# EAGLE design pcb (EAGLE 6.5.0)
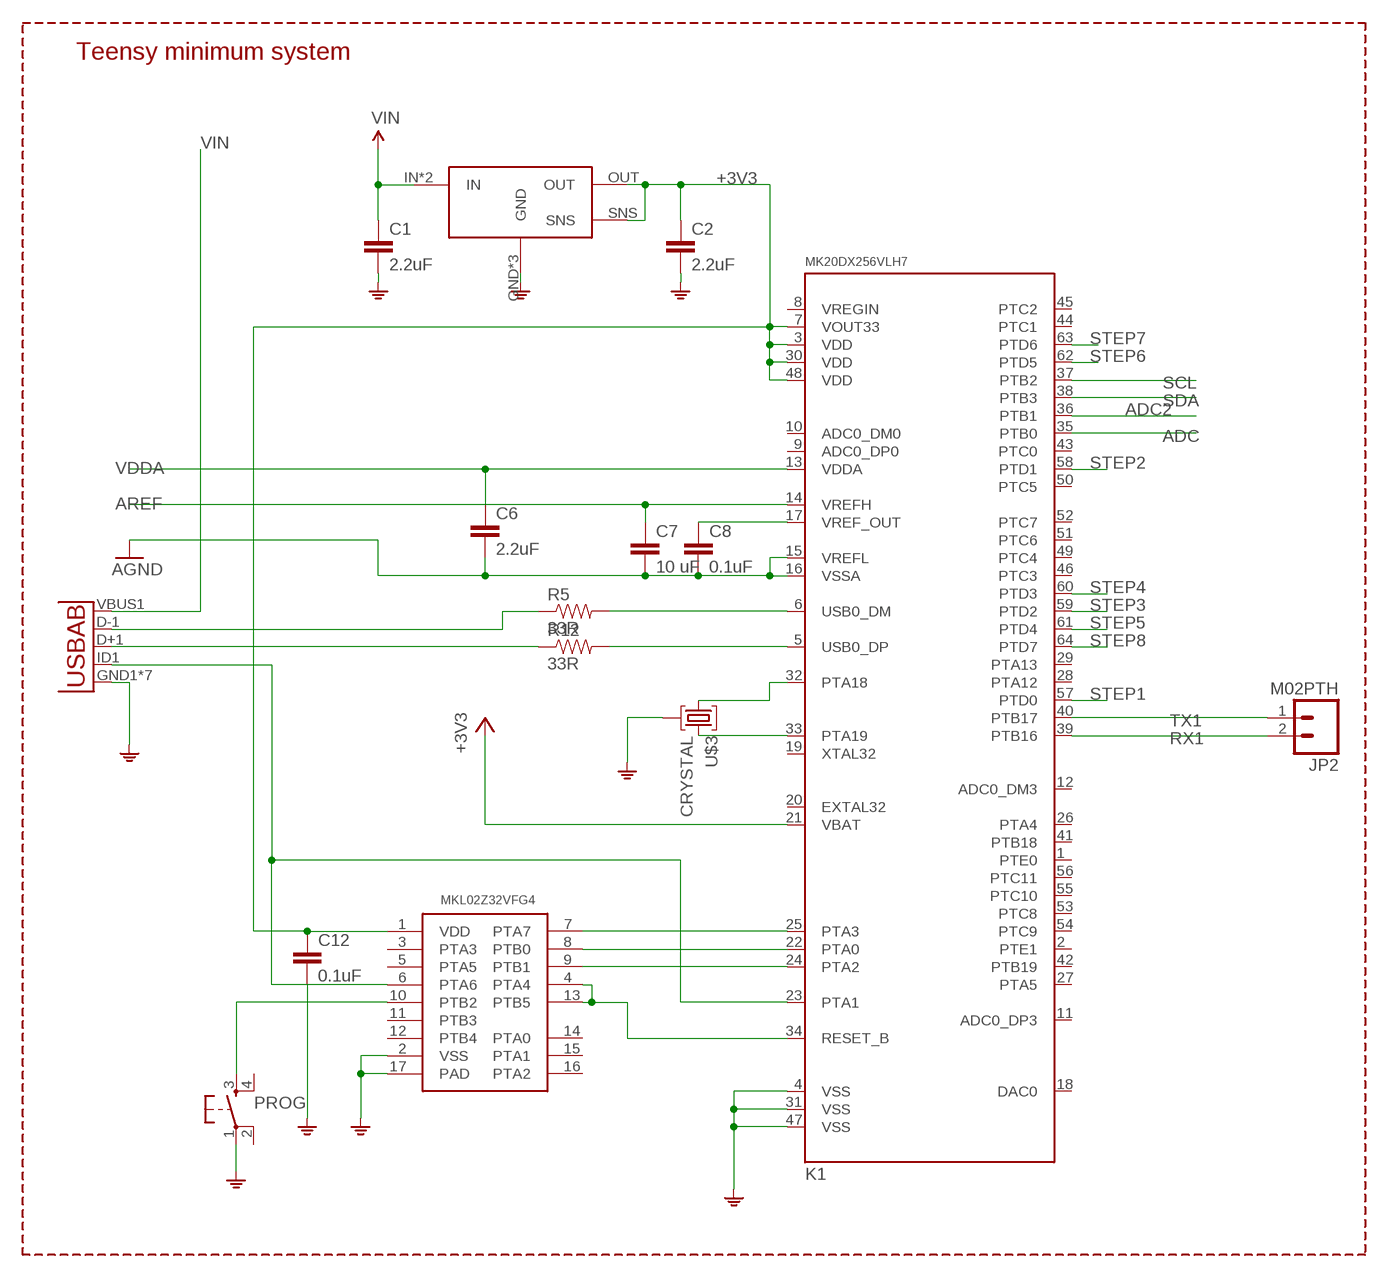
[diagram p0: schematic, sheet 1, part 1 of 2]
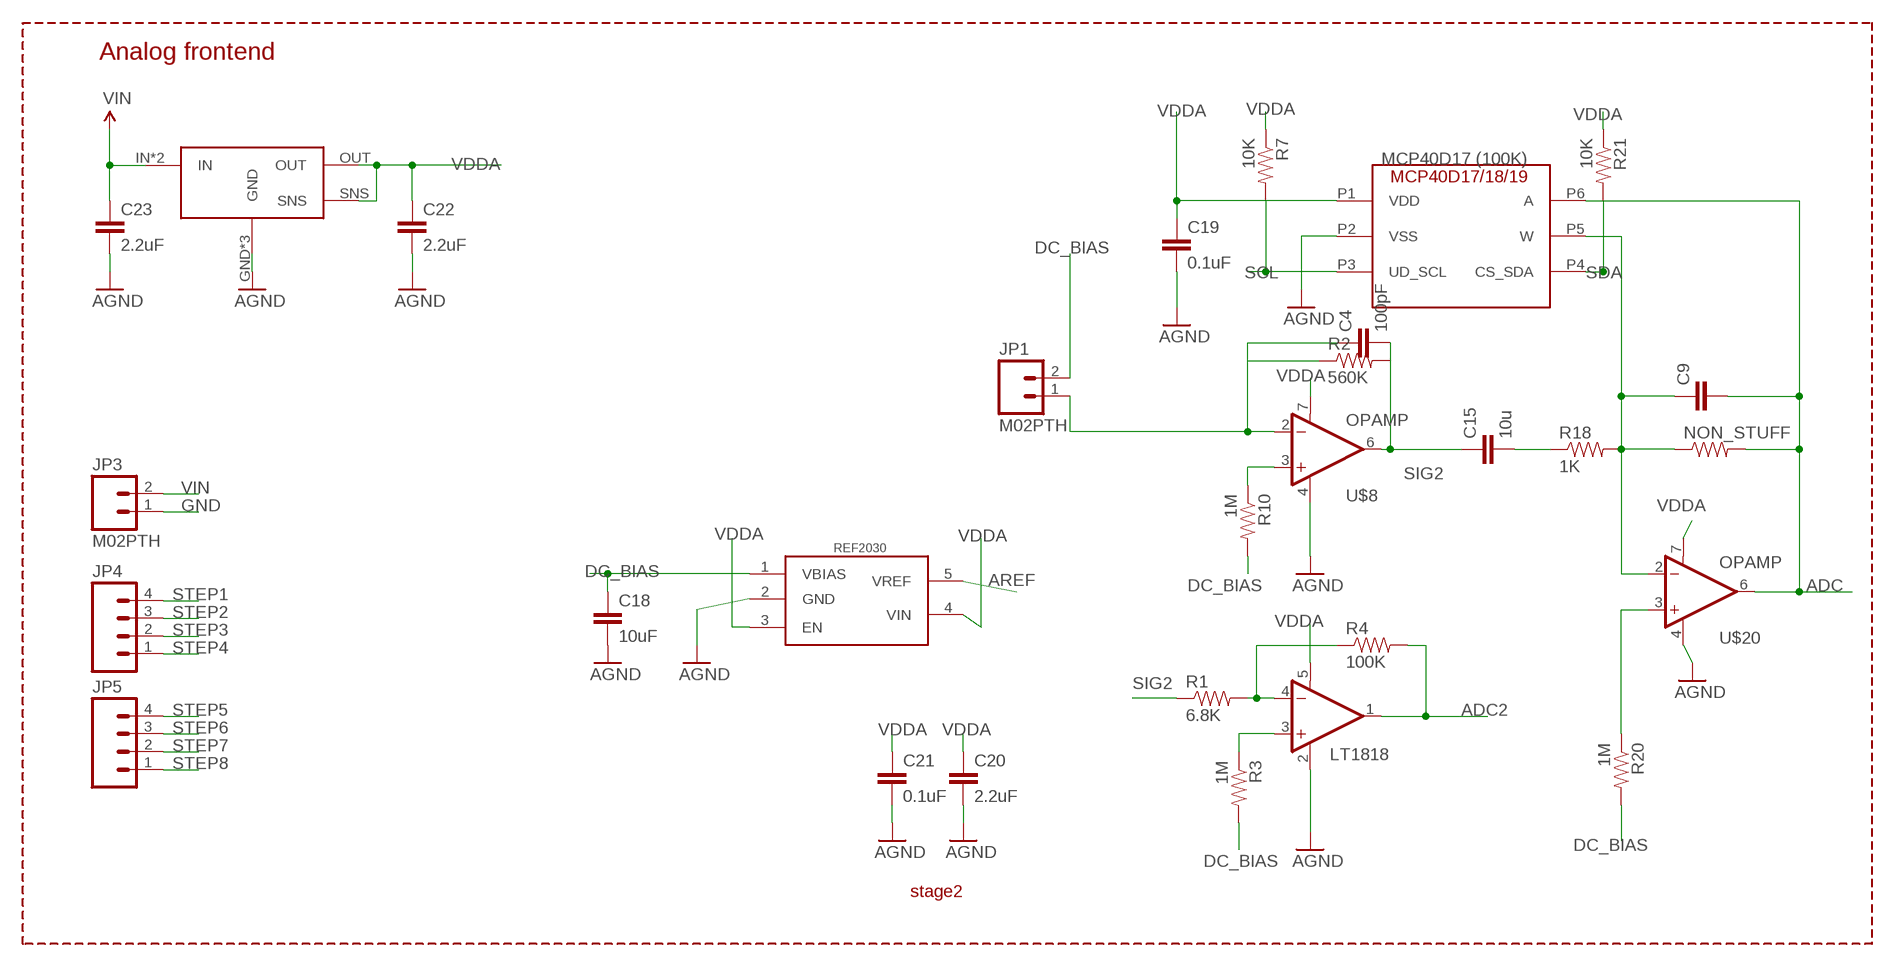
[diagram p1: schematic, sheet 1, part 2 of 2]

## Parts
C1  2.2uF  0.1UF-16V(+-10%)(0402)  [0402-CAP]
C2  2.2uF  0.1UF-16V(+-10%)(0402)  [0402-CAP]
C4  100pF  0.1UF-16V(+-10%)(0402)  [0402-CAP]
C6  2.2uF  0.1UF-16V(+-10%)(0402)  [0402-CAP]
C7  10 uF  0.1UF-16V(+-10%)(0402)  [0402-CAP]
C8  0.1uF  0.1UF-16V(+-10%)(0402)  [0402-CAP]
C9  C-EUC0402  [C0402]
C12  0.1uF  0.1UF-16V(+-10%)(0402)  [0402-CAP]
C15  10u  C-EUC0402  [C0402]
C18  10uF  0.1UF-16V(+-10%)(0402)  [0402-CAP]
C19  0.1uF  0.1UF-16V(+-10%)(0402)  [0402-CAP]
C20  2.2uF  0.1UF-25V(+80/-20%)(0603)  [0603-CAP]
C21  0.1uF  0.1UF-16V(+-10%)(0402)  [0402-CAP]
C22  2.2uF  0.1UF-16V(+-10%)(0402)  [0402-CAP]
C23  2.2uF  0.1UF-16V(+-10%)(0402)  [0402-CAP]
JP1  M02PTH  [1X02]
JP2  M02PTH  [1X02]
JP3  M02PTH  [1X02]
JP4  M04PTH  [1X04]
JP5  M04PTH  [1X04]
K1  MK20DX256VLH7  [LQFP64-05]
LP1  LP38691SD  [WSON_6]
LP38691  LP38691SD  [WSON_6]
NON_STUFF  RESISTOR0402  [0402-RES]
PROG  KMR211GLFS  TAC_SWITCHSMD  [TACTILE_SWITCH_SMD]
R1  6.8K  RESISTOR0402  [0402-RES]
R2  560K  RESISTOR0402  [0402-RES]
R3  1M  RESISTOR0402  [0402-RES]
R4  100K  RESISTOR0402  [0402-RES]
R5  33R  22OHM1/10W1%(0402)  [0402-RES]
R7  10K  RESISTOR0402  [0402-RES]
R10  1M  RESISTOR0402  [0402-RES]
R12  33R  22OHM1/10W1%(0402)  [0402-RES]
R18  1K  RESISTOR0402  [0402-RES]
R20  1M  RESISTOR0402  [0402-RES]
R21  10K  RESISTOR0402  [0402-RES]
REF2030  REF2033  [SOT23]
U5  USB""  [USB-MICRO-SMD]
U14  LT1818  OPA344  [SOT23-5]
U$3  CRYSTAL  [CRYSTAL]
U$6  MCP40D17/18/19  [SC70-6]
U$8  OPAMP  [8-SOIC]
U$14  MKL02Z32VFG4_  [QFN16_3X3]
U$20  OPAMP  [8-SOIC]

## Nets
+3V3: C2.1 C12.1 K1.3(VDD) K1.7(VOUT33) K1.21(VBAT) K1.30(VDD) K1.48(VDD) LP38691.OUT LP38691.SNS U$14.1(VDD)
ADC: C9.2 K1.35(PTB0) NON_STUFF.2 U$6.P6(A) U$20.6(OUT)
ADC2: K1.36(PTB1) R4.2 U14.1(OUT)
AGND: C6.2 C7.2 C8.2 C18.2 C19.2 C20.2 C21.2 C22.2 C23.2 K1.15(VREFL) K1.16(VSSA) LP1.GND LP1.N/C(GND) LP1.THERMAL(GND) REF2030.2(GND) U14.2(V-) U$6.P2(VSS) U$8.4(V-) U$20.4(V-)
AREF: C7.1 K1.14(VREFH) REF2030.5(VREF)
DC_BIAS: C18.1 JP1.2 R3.2 R10.2 R20.2 REF2030.1(VBIAS)
GND: C1.2 C2.2 C12.2 JP3.1 K1.4(VSS) K1.31(VSS) K1.47(VSS) LP38691.GND LP38691.N/C(GND) LP38691.THERMAL(GND) PROG.1 U5.GND1(GND) U5.P$1(GND) U5.P$2(GND) U5.P$3(GND) U5.P$4(GND) U5.P$5(GND) U5.P$6(GND) U$3.GND1 U$3.GND2 U$14.2(VSS) U$14.17(PAD)
N$1: C4.1 JP1.1 R2.1 U$8.2(-IN)
N$2: R1.2 R4.1 U14.4(-IN)
N$3: C9.1 NON_STUFF.1 R18.2 U$6.P5(W) U$20.2(-IN)
N$4: K1.32(PTA18) U$3.SIG1
N$5: K1.33(PTA19) U$3.SIG2
N$8: K1.24(PTA2) U$14.9(PTB1)
N$10: R10.1 U$8.3(+IN)
N$11: K1.22(PTA0) U$14.8(PTB0)
N$12: R3.1 U14.3(+IN)
N$14: C8.1 K1.17(VREF_OUT)
N$15: C15.2 R18.1
N$16: K1.5(USB0_DP) R12.2
N$17: K1.6(USB0_DM) R5.2
N$19: R12.1 U5.D+1(D+)
N$20: R5.1 U5.D-1(D-)
N$22: K1.23(PTA1) U5.ID1(USBID) U$14.6(PTA6)
N$23: R20.1 U$20.3(+IN)
N$66: PROG.3 U$14.10(PTB2)
N$72: K1.25(PTA3) U$14.7(PTA7)
RST: K1.34(RESET_B) U$14.4(PTA4) U$14.13(PTB5)
RX1: JP2.2 K1.39(PTB16)
SCL: K1.37(PTB2) R7.2 U$6.P3(UD_SCL)
SDA: K1.38(PTB3) R21.2 U$6.P4(CS_SDA)
SIG2: C4.2 C15.1 R1.1 R2.2 U$8.6(OUT)
STEP1: JP4.4 K1.57(PTD0)
STEP2: JP4.3 K1.58(PTD1)
STEP3: JP4.2 K1.59(PTD2)
STEP4: JP4.1 K1.60(PTD3)
STEP5: JP5.4 K1.61(PTD4)
STEP6: JP5.3 K1.62(PTD5)
STEP7: JP5.2 K1.63(PTD6)
STEP8: JP5.1 K1.64(PTD7)
TX1: JP2.1 K1.40(PTB17)
VDDA: C6.1 C19.1 C20.1 C21.1 C22.1 K1.13(VDDA) LP1.OUT LP1.SNS R7.1 R21.1 REF2030.3(EN) REF2030.4(VIN) U14.5(V+) U$6.P1(VDD) U$8.7(V+) U$20.7(V+)
VIN: C1.1 C23.1 JP3.2 LP1.IN LP1.IN2(IN) LP38691.IN LP38691.IN2(IN) U5.VBUS1(VBUS)
Unconnected: K1.1(PTE0) K1.2(PTE1) K1.8(VREGIN) K1.9(ADC0_DP0) K1.10(ADC0_DM0) K1.11(ADC0_DP3) K1.12(ADC0_DM3) K1.18(DAC0) K1.19(XTAL32) K1.20(EXTAL32) K1.26(PTA4) K1.27(PTA5) K1.28(PTA12) K1.29(PTA13) K1.41(PTB18) K1.42(PTB19) K1.43(PTC0) K1.44(PTC1) K1.45(PTC2) K1.46(PTC3) K1.49(PTC4) K1.50(PTC5) K1.51(PTC6) K1.52(PTC7) K1.53(PTC8) K1.54(PTC9) K1.55(PTC10) K1.56(PTC11) PROG.2 PROG.4 U$14.3(PTA3) U$14.5(PTA5) U$14.11(PTB3) U$14.12(PTB4) U$14.14(PTA0) U$14.15(PTA1) U$14.16(PTA2)

## Notes on the sheet
- Teensy minimum system
- Analog frontend
- MCP40D17 (100K)
- stage2

## Library data of the parts
C1 C2 C4 C6 C7 C18 C22 C23 = SparkFun-Capacitors:0.1UF-16V(+-10%)(0402); PROD_ID: CAP-12416; VALUE: 0.1uF
C8 C12 C19 C21 = SparkFun-Capacitors:0.1UF-16V(+-10%)(0402); PROD_ID: CAP-12416
C9 C15 = resistor:C-EU: CAPACITOR, European symbol
C20 = SparkFun-Capacitors:0.1UF-25V(+80/-20%)(0603): CAP-00810 Ceramic Standard decoupling cap; PROD_ID: CAP-00810; VALUE: 0.1uF
JP1-JP3 = SparkFun-Connectors:M02: Standard 2-pin 0.1" header. Use with - straight break away headers ( PRT-00116) - right angle break away headers (PRT-00553) - swiss pins (PRT-00743) - machine pins (PRT-00117) - female headers (PRT-00115) Molex polarized connector foot print use with: PRT-08233 with associated crimp pins and housings. 2.54_SCREWTERM for use with PRT-10571. 3.5mm Screw Terminal footprints for PRT-08084 5mm Screw Terminal footprints for use with PRT-08432
JP4 JP5 = SparkFun-Connectors:M04: Header 4 Standard 4-pin 0.1" header. Use with straight break away headers (SKU : PRT-00116), right angle break away headers (PRT-00553), swiss pins (PRT-00743), machine pins (PRT-00117), and female headers (PRT-00115). Molex polarized connector foot print use with SKU : PRT-08231 with associated crimp pins and housings. 1MM SMD Version SKU: PRT-10208
K1 = t32_ref:MK20DX256VLH7; DESC: MK20DX256VLH7; MF: NXP; MPN: MK20DX256VLH7; OC_MOUSER: 841-MK20DX256VLH7; PACKAGE: LQFP-64; TYPE: Microcontroller
LP1 LP38691 = Teensy_3_and_LC_Series_Boards_v1.1:LP38691SD
NON_STUFF R1-R4 R7 R10 R18 R20 R21 = SparkFun-Resistors:RESISTOR: Resistor Basic schematic elements and footprints for 0603, 1206, and PTH resistors.
PROG = Spark:TAC_SWITCH: SMD Tactiile Switch
R5 R12 = SparkFun-Resistors:22OHM1/10W1%(0402); PROD_ID: RES-12427; VALUE: 22
REF2030 = Teensy_3_and_LC_Series_Boards_v1.1:REF2033
U5 = MicroUSB:USB: This is a USB AB connector that is compatible with USB OTG. i.e. this connector can serve as a host or device
U14 = SparkFun:OPA344
U$3 = Teensy_3_and_LC_Series_Boards_v1.1:CRYSTAL
U$6 = ff3:MCP40D17/18/19
U$8 U$20 = Teensy_3_and_LC_Series_Boards_v1.1:OPAMP
U$14 = Teensy_3_and_LC_Series_Boards_v1.1:MKL02Z32VFG4_

## Board
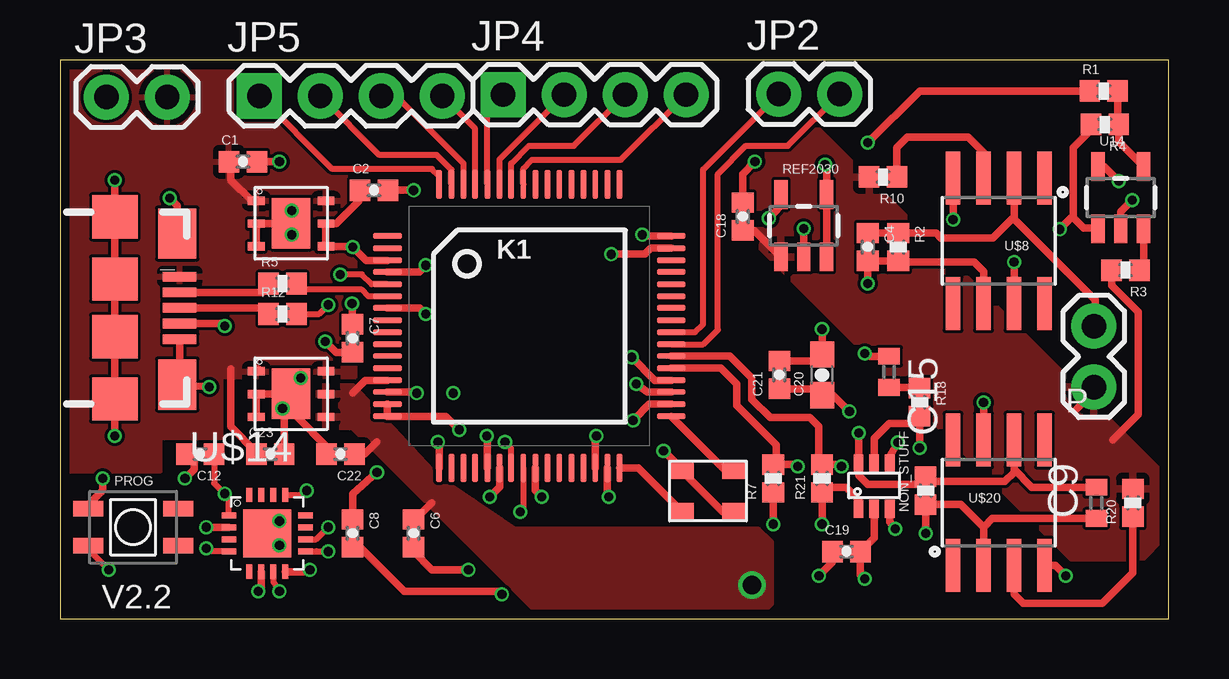
[diagram p2: board, top side]
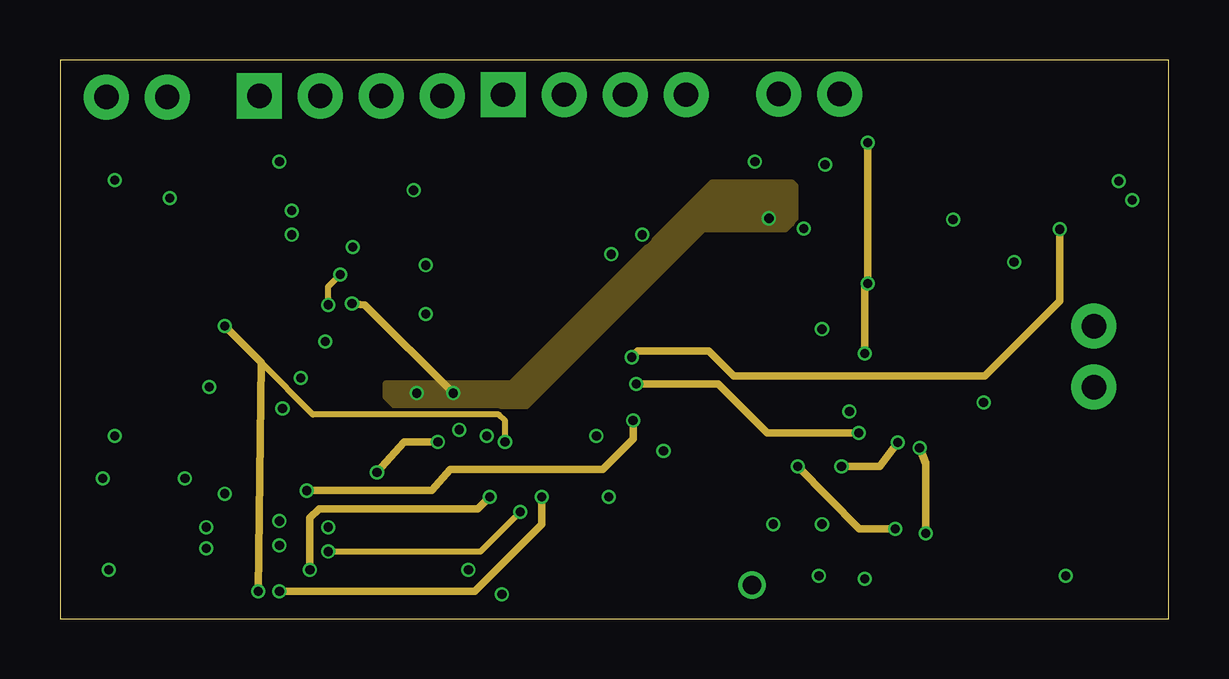
[diagram p3: board, inner layer Route2]
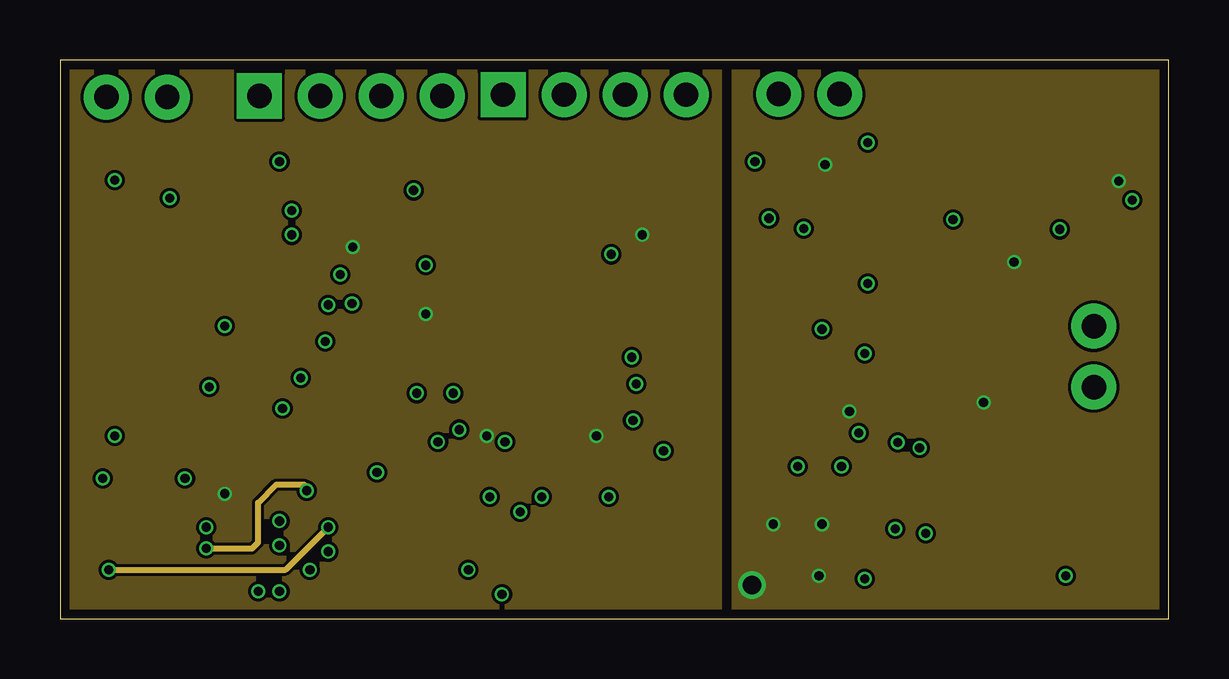
[diagram p4: board, inner layer Route15]
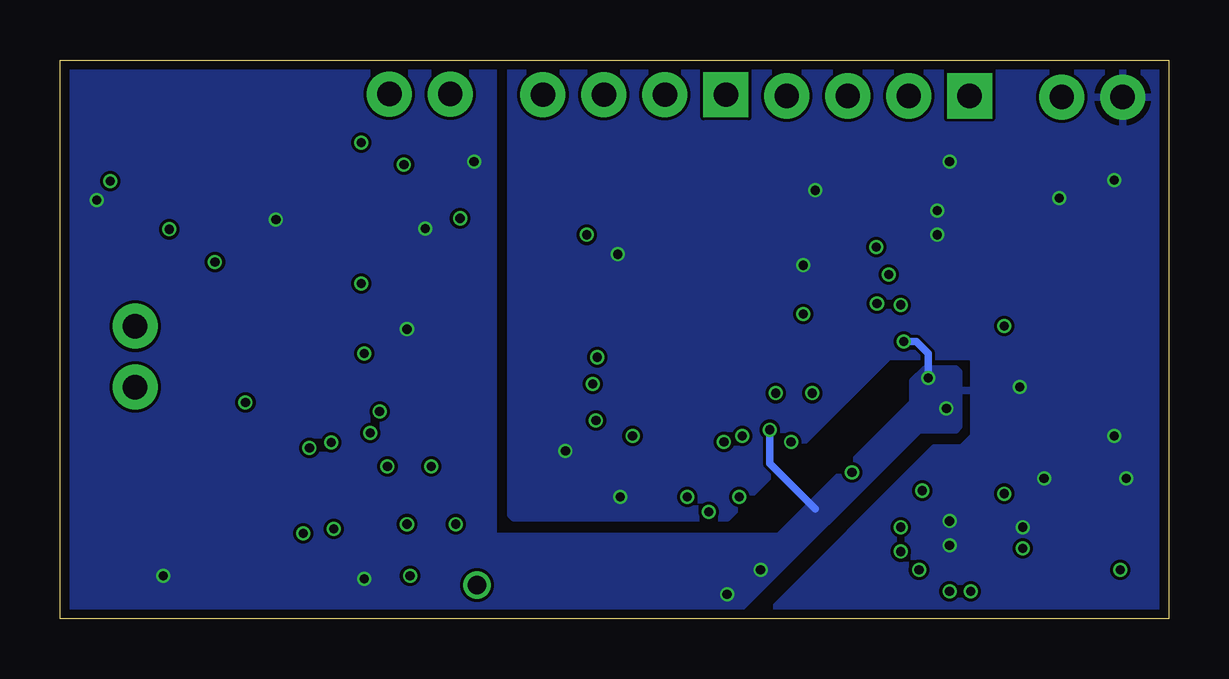
[diagram p5: board, bottom side, seen from below]

Size 46.21 x 23.29 mm. Coordinates in mm from the lower left corner, seen from the top.
Outline: 0,0 46.21,0 46.21,23.29 0,23.29 0,0
Copper layers (1*2*15*16): Top 0.035559375mm / dielectric 0.17018125mm / Route2 0.01778125mm / dielectric 47mil / Route15 0.01778125mm / dielectric 0.17018125mm / Bottom 0.035559375mm
Design rules "OSHPark-4layer": minimum track width 5mil, minimum drill 10mil, track to track 5mil, track to pad 5mil, pad to pad 5mil, via to via 5mil, smd to smd 5mil, copper to edge 15mil, drill to drill 6mil, minimum pad ring 4mil, minimum via ring 4mil, stop-mask expansion 2.5mil, vias tented up to drill 0mil, thermal gap 10mil

### Footprints (pad centres in the part's own frame; a part is rotated, then mirrored left to right if it is on the bottom)
0402-CAP = smd 0.85 x 0.9: 1 -0.58,0; 2 0.58,0
C0402 = smd 0.7 x 0.9: 1 -0.65,0; 2 0.65,0
0603-CAP = smd 1.1 x 1: 1 -0.85,0; 2 0.85,0
1X02 = drill 1.016 pad 1.88: 1 0,0; 2 2.54,0
1X04 = drill 1.016 pad 1.88 square: 1 0,0 | drill 1.016 pad 1.88: 2 2.54,0; 3 5.08,0; 4 7.62,0
LQFP64-05 = smd 1.2 x 0.25: 1 -5.915,3.759; 2 -5.915,3.251; 3 -5.915,2.743; 4 -5.915,2.261; 5 -5.915,1.753; 6 -5.915,1.245; 7 -5.915,0.762; 8 -5.915,0.254; 9 -5.915,-0.254; 10 -5.915,-0.762; 11 -5.915,-1.245; 12 -5.915,-1.753; 13 -5.915,-2.261; 14 -5.915,-2.743; 15 -5.915,-3.251; 16 -5.915,-3.759; 33 5.915,-3.759; 34 5.915,-3.251; 35 5.915,-2.743; 36 5.915,-2.261; 37 5.915,-1.753; 38 5.915,-1.245; 39 5.915,-0.762; 40 5.915,-0.254; 41 5.915,0.254; 42 5.915,0.762; 43 5.915,1.245; 44 5.915,1.753; 45 5.915,2.261; 46 5.915,2.743; 47 5.915,3.251; 48 5.915,3.759 | smd 0.25 x 1.2: 17 -3.759,-5.915; 18 -3.251,-5.915; 19 -2.743,-5.915; 20 -2.261,-5.915; 21 -1.753,-5.915; 22 -1.245,-5.915; 23 -0.762,-5.915; 24 -0.254,-5.915; 25 0.254,-5.915; 26 0.762,-5.915; 27 1.245,-5.915; 28 1.753,-5.915; 29 2.261,-5.915; 30 2.743,-5.915; 31 3.251,-5.915; 32 3.759,-5.915; 49 3.759,5.915; 50 3.251,5.915; 51 2.743,5.915; 52 2.261,5.915; 53 1.753,5.915; 54 1.245,5.915; 55 0.762,5.915; 56 0.254,5.915; 57 -0.254,5.915; 58 -0.762,5.915; 59 -1.245,5.915; 60 -1.753,5.915; 61 -2.261,5.915; 62 -2.743,5.915; 63 -3.251,5.915; 64 -3.759,5.915
WSON_6 = smd 0.7 x 0.35: GND -1.472,-0.042; IN -1.472,0.908; IN2 1.428,0.908; N/C -1.472,-0.992; OUT 1.428,-0.992; SNS 1.428,-0.042 | smd 1.6 x 2.1: THERMAL -0.024,-0.024
0402-RES = smd 0.85 x 0.9: 1 -0.58,0; 2 0.58,0
TACTILE_SWITCH_SMD = smd 1.25 x 0.65: 1 -1.875,0.775; 2 1.875,0.775; 3 -1.875,-0.775; 4 1.875,-0.775
SOT23 = smd 0.55 x 1.2: 1 -0.95,-1.3; 2 0,-1.3; 3 0.95,-1.3; 4 0.95,1.3; 5 -0.95,1.3
USB-MICRO-SMD = smd 1.4 x 0.4: D+1 2.7,0; D-1 2.7,0.65; GND1 2.7,-1.3; ID1 2.7,-0.65; VBUS1 2.7,1.3 | smd 1.6 x 2.1: P$1 2.6,3.1; P$2 2.6,-3.2 | smd 1.9 x 1.8: P$3 0,-3.8; P$4 0,3.8; P$5 0,1.2; P$6 0,-1.2
SOT23-5 = smd 0.55 x 1.2: 1 -0.95,-1.3; 2 0,-1.3; 3 0.95,-1.3; 4 0.95,1.3; 5 -0.95,1.3
CRYSTAL = smd 1 x 0.7: GND1 0.5,2.1; GND2 2.7,0.4; SIG1 0.5,0.4; SIG2 2.7,2.1
SC70-6 = smd 0.4 x 0.75: P1 -0.762,-1.016; P2 -0.112,-1.016; P3 0.538,-1.016; P4 0.538,0.884; P5 -0.112,0.884; P6 -0.762,0.884
8-SOIC = smd 0.61 x 2.21: 1 -1.905,-2.616; 2 -0.635,-2.616; 3 0.635,-2.616; 4 1.905,-2.616; 5 1.905,2.616; 6 0.635,2.616; 7 -0.635,2.616; 8 -1.905,2.616
QFN16_3X3 = smd 0.6 x 0.25: 1 -1.6,0.75; 2 -1.6,0.25; 3 -1.6,-0.25; 4 -1.6,-0.75; 9 1.6,-0.75; 10 1.6,-0.25; 11 1.6,0.25; 12 1.6,0.75 | smd 0.25 x 0.6: 5 -0.75,-1.6; 6 -0.25,-1.6; 7 0.25,-1.6; 8 0.75,-1.6; 13 0.75,1.6; 14 0.25,1.6; 15 -0.25,1.6; 16 -0.75,1.6 | smd 2 x 2: 17 0,0

### Placement (x,y rotation side)
C1  7.62,19.05 0 top
C2  13.08,17.86 0 top
C4  33.66,15.49 270 top
C6  14.73,3.56 270 top
C7  12.19,11.68 270 top
C8  12.19,3.56 270 top
C9  43.18,4.83 90 top
C12  5.84,6.86 180 top
C15  34.54,10.29 270 top
C18  28.45,16.76 90 top
C19  32.77,2.79 0 top
C20  31.75,10.16 90 top
C21  29.97,10.16 90 top
C22  11.68,6.86 180 top
C23  8.76,6.86 0 top
JP1  43.08,12.19 270 top
JP2  29.95,21.87 0 top
JP3  1.93,21.74 0 top
JP4  18.47,21.84 0 top
JP5  8.31,21.79 0 top
K1  19.56,12.19 0 top
LP1  9.65,9.4 0 top
LP38691  9.65,16.51 0 top
NON_STUFF  36.07,5.33 90 top
PROG  3.05,3.81 0 top
R1  43.48,22 0 top
R2  34.92,15.49 270 top
R3  44.4,14.53 180 top
R4  43.54,20.6 180 top
R5  9.27,13.97 0 top
R7  29.72,5.84 90 top
R10  34.29,18.41 180 top
R12  9.27,12.7 0 top
R18  35.81,9.02 270 top
R20  44.7,4.83 90 top
R21  31.75,5.84 90 top
REF2030  30.99,16.38 0 top
U5  2.29,12.95 0 top
U14  44.2,17.55 0 top
U$3  25.4,4.06 0 top
U$6  34.04,5.59 0 top
U$8  39.12,15.75 180 top
U$14  8.64,3.56 0 top
U$20  39.12,4.83 0 top

### Tracks (layer width: path | path; a pad name or v marks a point on that pad's centre or on a via)
+3V3  (via drill 0.38)
  Top 0.254: U$14.1 7.04,5.03 v6.86,5.21 6.42,5.64 C12.1
  Top 0.305: K1.3 12.75,14.94 v12.19,15.49 12.17,15.52 LP38691.OUT LP38691.SNS 11.52,16.47 12.45,17.4 12.5,17.57 C2.1 | K1.7 14.99,12.95 v15.24,12.7 | K1.21 17.8,7.59 v17.78,7.62 | K1.30 22.3,7.57 v22.35,7.62 | K1.48 24.31,15.95 v24.26,16
  pour Route15: 0,23.62 27.43,23.62 27.43,0 0,0
ADC  (via drill 0.38)
  Top 0.305: C9.2 40.5,5.48 39.75,6.22 | 39.75,6.22 U$20.6 | K1.35 24.46,9.45 v24,9.78 | 39.75,6.22 39.75,6.1 39.37,5.72 36.27,5.72 NON_STUFF.2 35.74,5.59 33.66,5.59 33.27,5.97 U$6.P6 v33.27,7.75
  Route2 0.305: v24,9.78 27.43,9.78 29.46,7.75 v33.27,7.75
ADC2  (via drill 0.38)
  Top 0.305: R4.2 42.96,20.38 42.22,19.63 42.22,16.71 | 42.22,16.71 42.65,16.28 43.22,16.28 U14.1 | K1.36 24.79,9.93 v23.82,10.9 | 42.22,16.71 42.14,16.71 v41.66,16.23
  Route2 0.305: v41.66,16.23 41.66,13.23 38.53,10.11 28.07,10.11 27.03,11.15 24.08,11.15 v23.82,10.9
AGND  (via drill 0.38)
  Top 0.305: U$8.4 v37.21,16.64 | REF2030.2 v30.99,16.26 | C18.2 28.45,18.54 v28.96,19.05 | v31.75,12.07 C20.2 31.48,10.74 C21.2 | v33.53,1.65 33.35,1.83 C19.2 33.92,3.37 U$6.P2 | U$20.4 41.48,2.21 v41.91,1.78 | LP1.THERMAL 9.61,9.36 LP1.GND LP1.N/C | 14.99,2.92 14.93,2.98 C6.2 14.73,2.79 15.49,2.03 v17.02,2.03 | LP1.THERMAL 9.27,9.02 v9.27,8.76 9.34,8.69 C23.2 | v10.03,10.03 10.03,9.78 LP1.THERMAL | C22.2 11.1,7.18 9.91,8.38 9.91,8.76 9.78,8.89 9.78,9.22 LP1.THERMAL | v16.64,7.87 16.08,8.43 K1.16 K1.15 | C8.2 12.52,2.98 14.35,1.14 18.29,1.14 v18.41,1.02 | C7.2 11.5,11.1 v11.05,11.56 | U14.2 44.2,16.97 v44.68,17.45
  Bottom 0.305: v16.64,7.87 16.64,6.48 14.73,4.57 | v10.03,10.03 10.03,11.05 10.54,11.56 v11.05,11.56
  pour Bottom: 28.19,23.11 46.23,23.11 46.23,0.25 28.19,0.25
  pour Bottom: 8.89,10.41 10.16,10.41 10.67,9.91 10.67,9.02 16.26,3.43 29.46,3.43 29.97,2.92 29.97,0.38 29.72,0.13 18.16,0.13 10.41,7.87 8.89,7.87 8.76,8 8.76,10.29
AREF  (via drill 0.38)
  Top 0.305: K1.14 14.81,9.45 v14.86,9.4 | REF2030.5 30.04,17.21 v29.54,16.69 | C7.1 v12.17,13.13
  Route2 0.305: v12.17,13.13 12.7,13.08 v16.38,9.4
  pour Route2: 13.59,9.78 18.8,9.78 27.18,18.16 30.48,18.16 30.61,18.03 30.61,16.64 30.23,16.26 26.8,16.26 19.43,8.89 13.97,8.89 13.59,9.27
DC_BIAS
  Top 0.305: C18.1 28.94,16.18 REF2030.1 | JP1.2 43.08,9.45 42.39,8.76 | R3.2 43.82,13.89 44.93,12.78 44.93,8.51 43.87,7.44
  pour Top: 28.19,20.96 30.99,20.96 45.85,6.1 45.85,3.3 45.09,2.54 42.16,2.54 28.07,16.64 28.07,20.83
GND  (via drill 0.38)
  Top 0.305: C1.2 v9.14,19.05 | C2.2 v14.73,17.86 | U5.P$1 4.89,17.21 v4.57,17.53 | v2.29,7.62 U5.P$3 U5.P$6 U5.P$5 U5.P$4 v2.29,18.29 | v6.22,9.65 5.39,9.71 U5.P$2 4.99,9.85 U5.GND1 | PROG.1 1.03,4.58 1.78,5.33 v1.78,5.84 | LP38691.N/C LP38691.GND 9.61,16.47 LP38691.THERMAL 9.65,16.46 v9.65,16 | K1.4 14.96,14.45 v15.24,14.73 | U$3.GND2 28.18,4.46 28.19,4.44 27.62,4.44 U$3.GND1 25.9,6.23 v25.15,6.99 | K1.31 22.81,5.13 v22.86,5.08 | 22.91,15.14 v22.96,15.19 24.36,15.19 24.61,15.44 K1.47 | C12.2 5.59,6.86 5.59,6.22 v5.21,5.84 | U$14.2 v6.1,3.81 | v9.14,3.05 U$14.17
  other vias: 9.65,17.02 9.14,4.06
  pour Bottom: -0.13,23.75 27.43,23.75 27.43,4.32 27.3,4.19 18.41,4.19 11.68,10.92 8.26,10.92 8.13,10.8 8.13,7.62 8.64,7.11 9.78,7.11 16.89,0 -0.13,0
N$1
  Top 0.305: 39.75,16.76 U$8.2 | C4.1 R2.1 36.5,16.07 36.7,15.88 38.86,15.88 39.75,16.76 | 39.75,16.76 39.75,16.66 43.13,13.28 43.13,12.24 JP1.1
N$2
  Top 0.305: R1.2 44.06,20.65 R4.1 44.12,19.88 U14.4
N$3  (via drill 0.38)
  Top 0.305: C9.1 38.85,4.18 38.48,3.81 | 38.48,3.81 U$20.2 | 38.48,3.81 37.54,4.75 NON_STUFF.1 v36.07,3.56 | U$6.P5 33.92,7.51 34.54,8.13 35.51,8.13 R18.2 v35.81,7.11
  Route2 0.305: v36.07,3.56 36.07,6.48 v35.81,7.11
N$4
  Top 0.305: K1.32 24.09,6.28 U$3.SIG1
N$5
  Top 0.305: U$3.SIG2 27.74,6.16 K1.33
N$6
  pour Bottom: 7.72,9.6 9.19,9.6 9.19,9.42 7.72,9.42
N$8  (via drill 0.38)
  Top 0.254: U$14.9 10.68,2.81 v11.18,2.79 | K1.24 19.3,4.57 v19.18,4.44
  Route2 0.254: v11.18,2.79 17.53,2.79 v19.18,4.44
N$10
  Top 0.305: R10.1 34.87,19.63 35.31,20.07 37.85,20.07 38.61,19.3 38.61,18.49 U$8.3
N$11  (via drill 0.38)
  Top 0.305: K1.22 18.31,5.49 v17.91,5.08 | U$14.8 10.34,1.96 v10.41,2.03
  Route2 0.305: v10.41,2.03 10.41,4.19 10.79,4.57 17.4,4.57 v17.91,5.08
N$12
  Top 0.305: U14.3 45.15,14.7 R3.1
N$14  (via drill 0.38)
  Top 0.305: K1.17 15.8,7.32 v15.75,7.37 | C8.1 12.19,5.21 v13.21,6.1
  Route2 0.305: v13.21,6.1 14.35,7.37 v15.75,7.37
N$15
  Top 0.305: C15.2 35.77,9.64 R18.1
N$16  (via drill 0.38)
  Top 0.254: R12.2 10.79,12.7 v11.18,13.08 | K1.5 12.98,13.95 12.57,14.35 v11.68,14.35
  Route2 0.254: v11.18,13.08 11.18,13.84 v11.68,14.35
N$17
  Top 0.254: K1.6 12.85,13.44 12.57,13.72 10.11,13.72 R5.2
N$19
  Top 0.305: U5.D+1 8.51,12.95 R12.1
N$20
  Top 0.305: U5.D-1 8.42,13.6 R5.1
N$22  (via drill 0.38)
  Top 0.254: K1.23 18.8,7.11 v18.54,7.37
  Top 0.305: U$14.6 8.39,1.27 v8.26,1.14 | U5.ID1 6.75,12.3 v6.86,12.19
  Route2 0.254: v18.54,7.37 18.54,8.25 18.29,8.51 10.54,8.51 8.38,10.67
  Route2 0.305: v8.26,1.14 8.38,10.67 v6.86,12.19
N$23
  Top 0.305: R20.1 44.7,1.91 43.43,0.63 40.13,0.63 39.75,1.02 U$20.3
N$66  (via drill 0.38)
  Top 0.254: U$14.10 10.67,3.31 v11.18,3.81 | PROG.3 1.03,3.04 v2.03,2.03
  Route15 0.254: v2.03,2.03 9.4,2.03 v11.18,3.81
N$72  (via drill 0.38)
  Top 0.254: U$14.7 8.89,1.53 v9.14,1.14
  Top 0.305: K1.25 19.81,5.33 v20.07,5.08
  Route2 0.305: v9.14,1.14 17.27,1.14 20.07,3.94 v20.07,5.08
RST  (via drill 0.38)
  Top 0.254: U$14.4 6.21,2.81 v6.1,2.92 | U$14.13 9.98,5.16 v10.29,5.33
  Top 0.305: K1.34 24.56,8.94 v23.88,8.25
  Route2 0.305: v10.29,5.33 15.49,5.33 16.26,6.22 22.61,6.22 23.88,7.49 v23.88,8.25
  Route15 0.254: v6.1,2.92 8,2.92 8.26,3.17 8.26,4.83 9.02,5.59 10.16,5.59 v10.29,5.33
RX1
  Top 0.254: K1.39 26.8,11.43 27.41,12.04 27.41,18.54 28.57,19.71 30.33,19.71 JP2.2
SCL  (via drill 0.38)
  Top 0.305: K1.37 27.53,10.44 28.19,9.78 28.19,8.89 29.84,7.24 29.84,6.55 R7.2 30.66,6.42 v30.73,6.35 | U$6.P3 34.57,4.03 v34.8,3.73
  Route2 0.305: v30.73,6.35 33.3,3.73 v34.8,3.73
SDA  (via drill 0.38)
  Top 0.305: U$6.P4 34.57,6.76 v34.9,7.34 | K1.38 27.91,10.95 28.83,10.03 28.83,9.14 29.59,8.38 31.24,8.38 31.62,8 31.62,6.55 R21.2 32.44,6.42 v32.56,6.35
  Route2 0.305: v32.56,6.35 34.16,6.35 v34.9,7.34
SIG2  (via drill 0.38)
  Top 0.305: U$8.6 38.48,14.48 38.1,14.86 34.98,14.86 R2.2 C4.2 v33.66,13.97 | C15.1 33.77,10.94 v33.53,11.05 | R1.1 35.81,22 v33.66,19.84
  Route2 0.305: v33.53,11.05 33.53,13.84 v33.66,13.97 v33.66,19.84
STEP1
  Top 0.254: K1.57 19.3,18.77 19.66,19.13 23.37,19.13 JP4.4
STEP2
  Top 0.254: K1.58 18.8,18.97 19.53,19.71 21.41,19.71 JP4.3
STEP3
  Top 0.254: K1.59 18.31,19.15 JP4.2
STEP4
  Top 0.254: K1.60 17.8,21.18 JP4.1
STEP5
  Top 0.254: K1.61 17.3,20.42 JP5.4
STEP6
  Top 0.254: K1.62 16.82,18.97 14.05,21.74 13.44,21.74 JP5.3
STEP7
  Top 0.254: K1.63 16.31,18.72 15.7,19.33 13.31,19.33 JP5.2
STEP8
  Top 0.254: K1.64 15.8,18.44 15.49,18.75 11.35,18.75 JP5.1
TX1
  Top 0.254: K1.40 26.47,11.94 26.8,12.27 26.8,18.72 JP2.1
VDDA  (via drill 0.38, 0.76)
  Top 0.305: U$20.7 v38.48,9.02 | U$8.7 v39.75,14.86 | v32.89,8.64 32.22,9.31 C20.1 31.48,9.58 C21.1 | v31.88,18.92 31.94,18.86 REF2030.4 REF2030.3 | C19.1 32.19,2.34 v31.62,1.78 | v31.75,3.94 R21.1 32.06,5.46 32.77,5.46 33.27,4.95 U$6.P1 | R7.1 v29.72,3.94 | K1.13 12.72,9.93 12.19,9.4 | C6.1 14.8,4.14 15.49,4.83 | C22.1 12.7,6.86 13.21,7.37 | U14.5 43.51,18.85 v44.12,18.24
  other vias: 28.83,1.4
  pour Route15: 28.19,23.62 46.99,23.62 46.99,0 28.19,0
  pour Top: 10.79,9.65 12.19,9.65 15.75,5.84 18.92,3.68 29.08,3.68 29.59,3.17 29.59,0.63 29.08,0.13 20.07,0.13 12.19,8 10.79,8
VIN
  Top 0.305: LP38691.IN 7.98,17.42 7.11,18.29 7.11,18.98 C1.1 | LP1.IN 8.24,10.31 8.26,10.29 8.26,10.41 | C23.1 8.18,6.93 7.11,8 7.11,10.41
  pour Top: 0,24.13 12.32,24.13 12.32,10.03 6.73,10.03 6.73,7.49 4.19,7.49 4.19,6.1 0,6.1

### Text on the board
tPlace: P | V2.2